# EAGLE design Temp_Control (EAGLE 9.6.2)
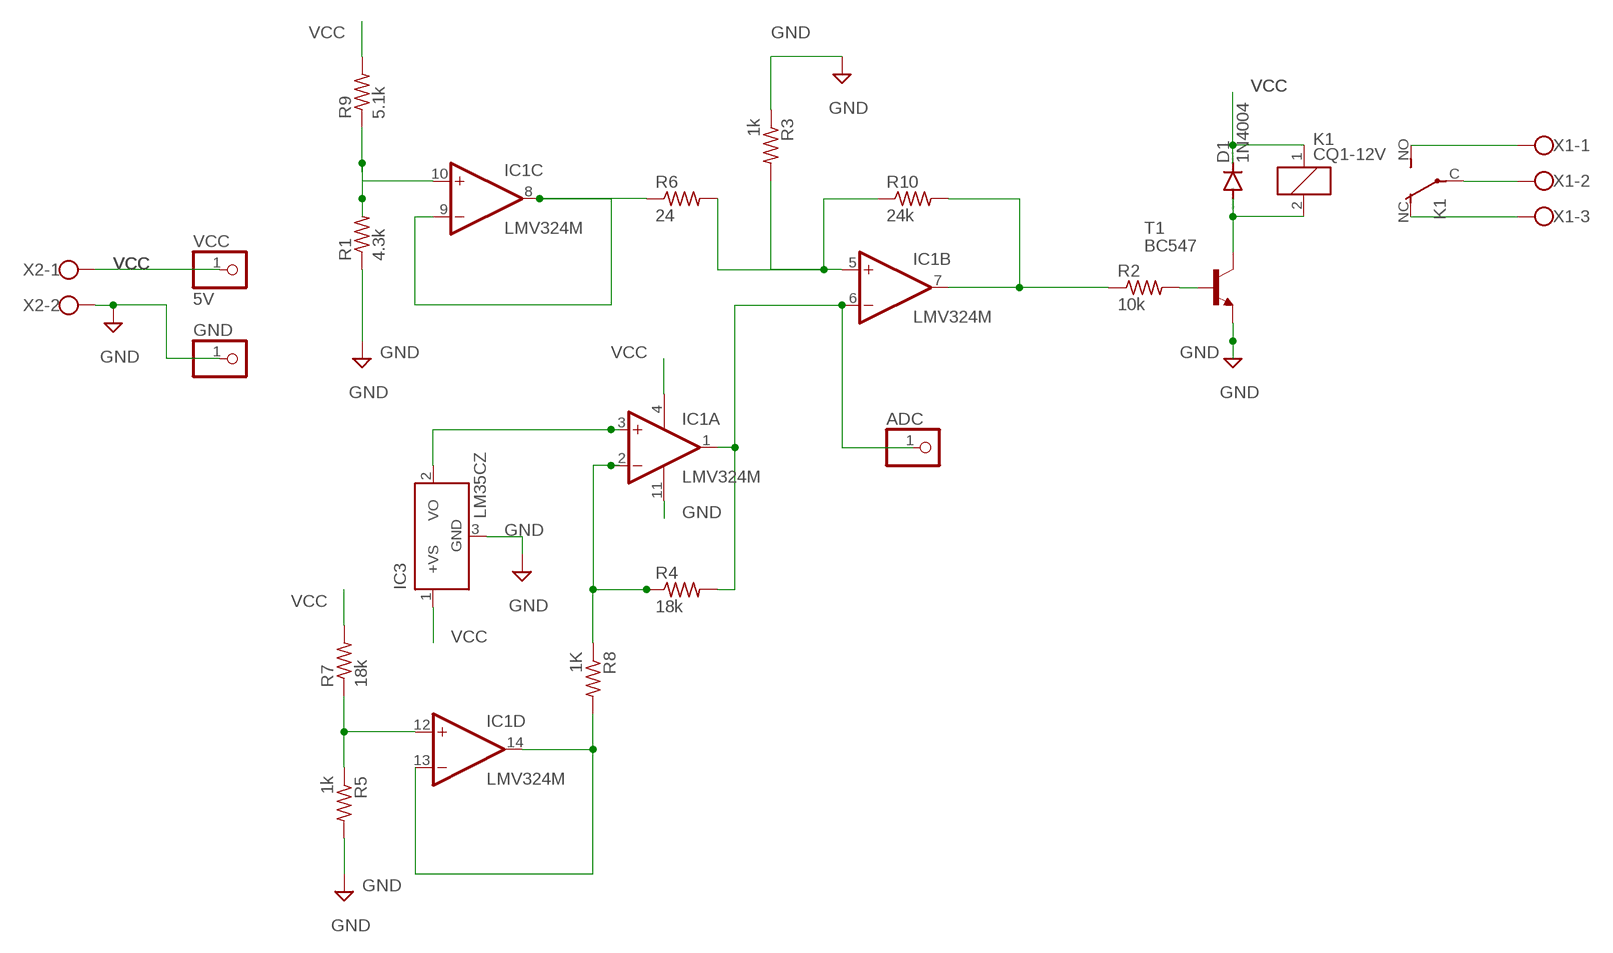
[diagram p0: schematic, sheet 1]

## Parts
ADC  PINHD-1X1  [1X01]
D1  1N4004  [DO41-10]
GND  PINHD-1X1  [1X01]
IC1  LMV324M  [SO14]
IC3  LM35CZ  [TO92]
K1  CQ1-12V  [CQ1]
R1  4.3k  R-US_0207/10  [0207/10]
R2  10k  R-US_0207/10  [0207/10]
R3  1k  R-US_0207/10  [0207/10]
R4  18k  R-US_0207/10  [0207/10]
R5  1k  R-US_0207/10  [0207/10]
R6  24  R-US_0207/10  [0207/10]
R7  18k  R-US_0207/10  [0207/10]
R8  1K  R-US_0207/10  [0207/10]
R9  5.1k  R-US_0207/10  [0207/10]
R10  24k  R-US_0207/10  [0207/10]
T1  BC547  [TO92]
VCC  5V  PINHD-1X1  [1X01]
X1  W237-103  [W237-103]
X2  W237-102  [W237-102]

## Nets
GND: GND.1 IC1.11(P:V-) IC3.3(GND) R1.1 R3.1 R5.2 T1.1(E) X2.2
N$1: IC1.3(A:+IN) IC3.2(VO)
N$2: IC1.2(A:-IN) R4.1 R8.1
N$3: ADC.1 IC1.1(A:OUT) IC1.6(B:-IN) R4.2
N$4: IC1.5(B:+IN) R3.2 R6.2 R10.1
N$5: IC1.7(B:OUT) R2.1 R10.2
N$6: IC1.10(C:+IN) R1.2 R9.1
N$7: IC1.8(C:OUT) IC1.9(C:-IN) R6.1
N$8: IC1.13(D:-IN) IC1.14(D:OUT) R8.2
N$9: R2.2 T1.2(B)
N$10: IC1.12(D:+IN) R5.1 R7.1
N$11: D1.A K1.2 T1.3(C)
N$12: K1.NO(2:S) X1.1
N$13: K1.C(2:P) X1.2
N$14: K1.NC(2:O) X1.3
VCC: D1.C IC1.4(P:V+) IC3.1(+VS) K1.1 R7.2 R9.2 VCC.1 X2.1

## Library data of the parts
ADC GND VCC = pinhead:PINHD-1X1: PIN HEADER
D1 = diode:1N4004: DIODE general purpose rectifier, 1 A
IC1 = linear:LMV324?*: Quad General Purpose, Low Voltage, Rail-to-Rail Output Operational Amplifiers Source: http://www.national.com/mpf/LM/LMV321.html http://www.national.com/dt/lmv_qual.pdf
IC3 = lm35:LM35: Single-Supply Centigrade Temperature Sensor Vout = (10mV/°C x Temp °C) +5mmmV Source: http://www.national.com/ds/LM/LM35.pdf
K1 = relay:CQ1-12V: AUTOMOTIVE QUIET RELAY NAiS Source: http://www.mew-europe.com/.. en_ds_61208_0000.pdf; OC_FARNELL: unknown; OC_NEWARK: unknown
R1-R10 = rcl:R-US_: RESISTOR, American symbol; SPICEPREFIX: R
T1 = transistor:BC547: NPN TRANSISTOR
X1 = con-wago-500:W237-103: WAGO SCREW CLAMP; MPN: 237-103; OC_FARNELL: unknown; OC_NEWARK: 18M7116
X2 = con-wago-500:W237-102: WAGO SCREW CLAMP; MPN: 237-102; OC_FARNELL: unknown; OC_NEWARK: 70K9898

## Board
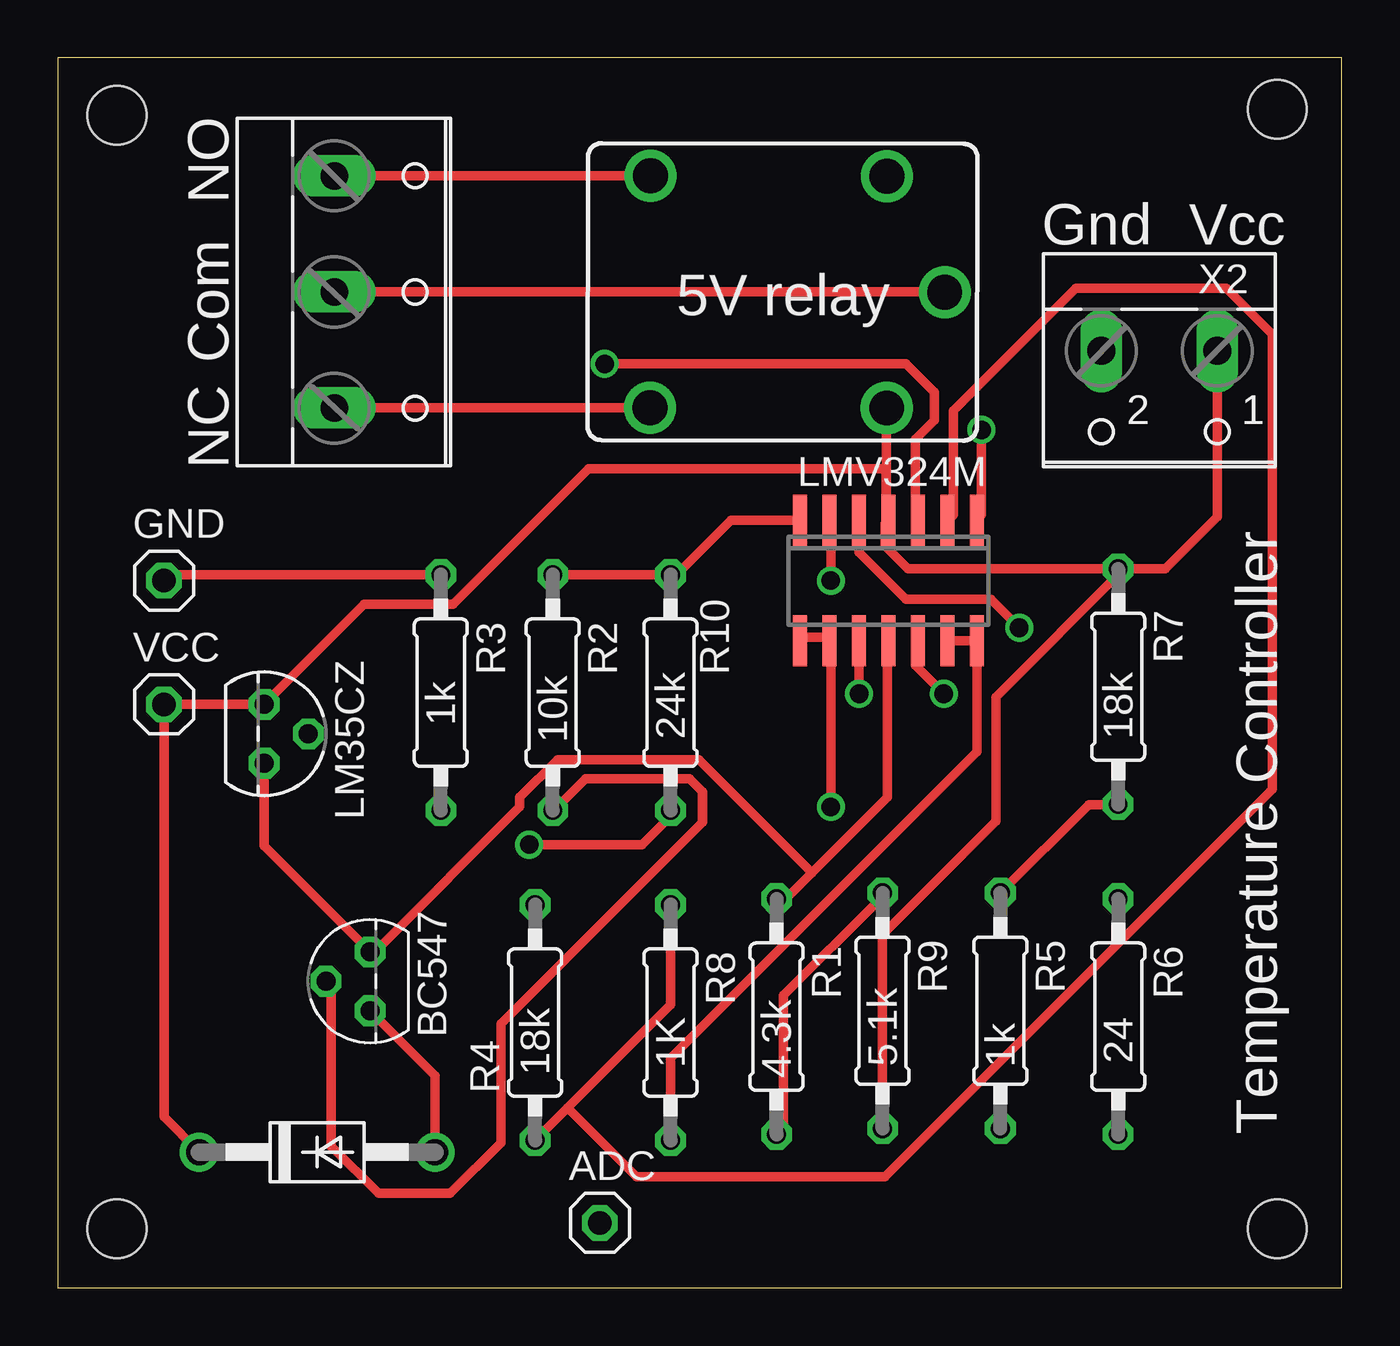
[diagram p1: board, top side]
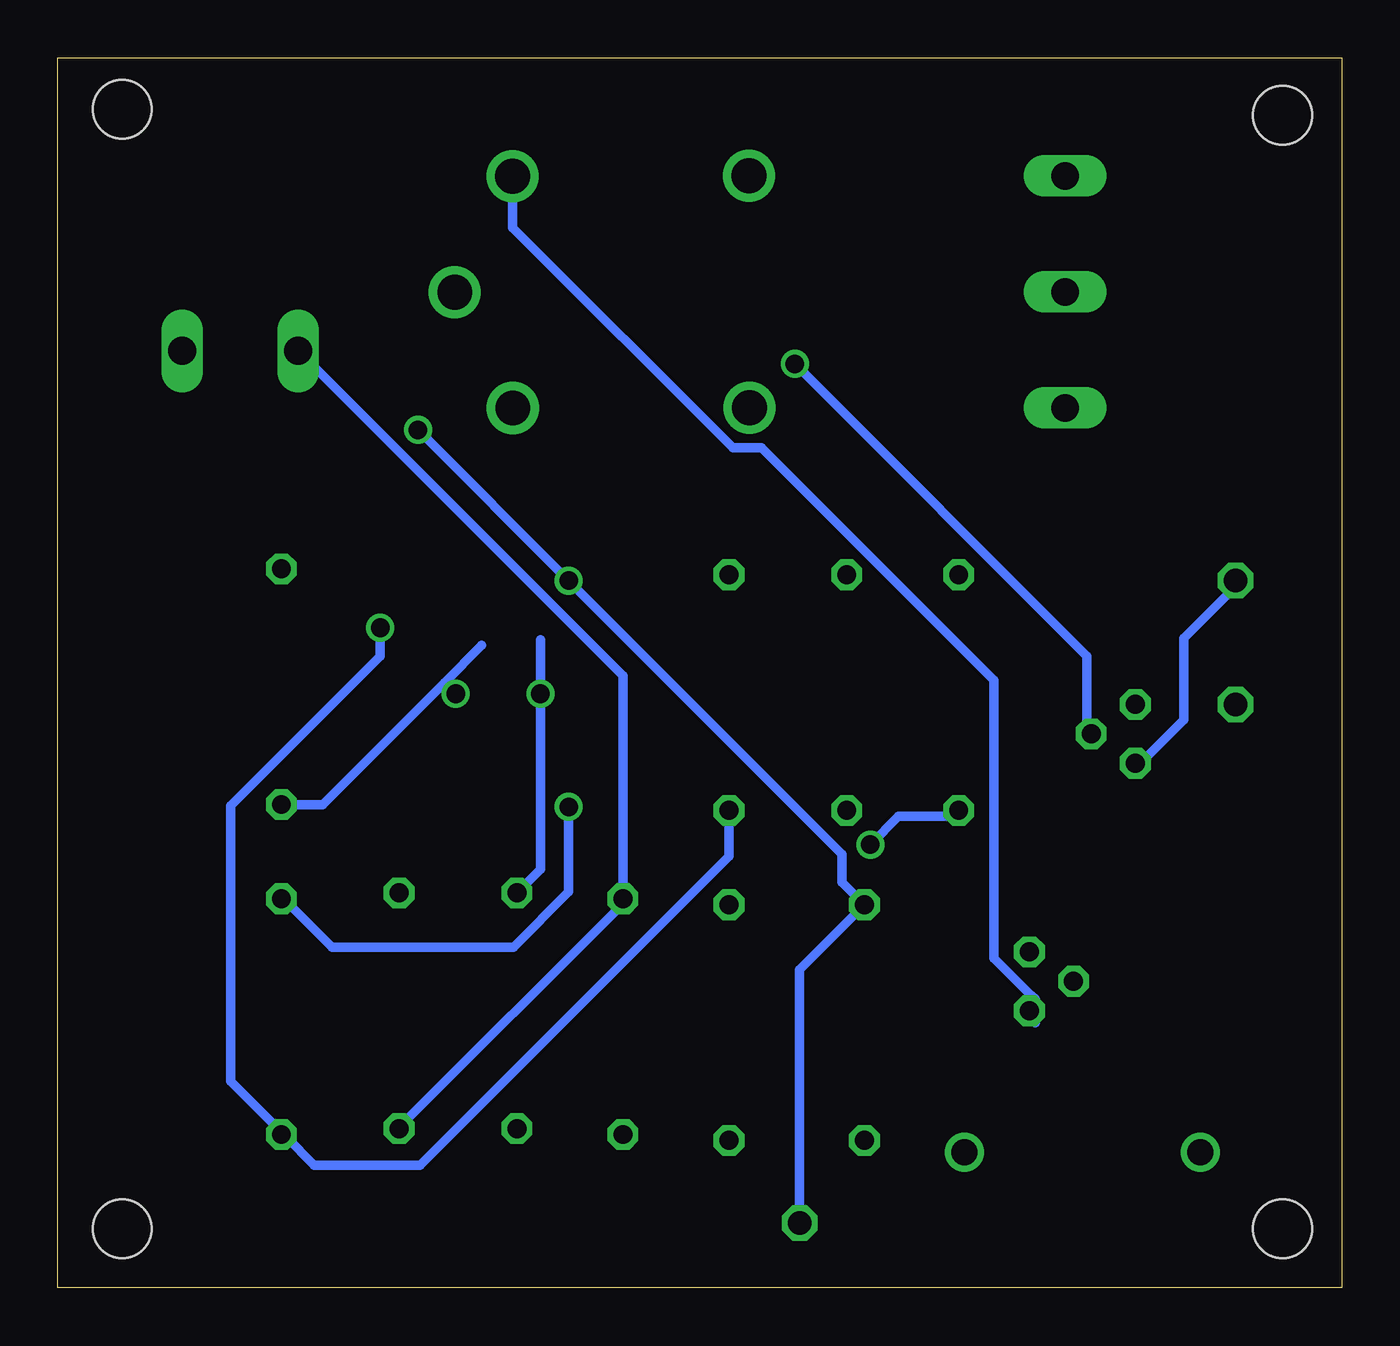
[diagram p2: board, bottom side, seen from below]

Size 55.35 x 53.01 mm. Coordinates in mm from the lower left corner, seen from the top.
Outline: 0,0 55.35,0 55.35,53.01 0,53.01 0,0
Copper layers (1*16): Top 0.035mm / dielectric 1.5mm / Bottom 0.035mm
Design rules "default *": minimum track width 16mil, minimum drill 0.8mm, track to track 16mil, track to pad 16mil, pad to pad 16mil, via to via 16mil, smd to smd 16mil, copper to edge 40mil, drill to drill 6mil, minimum pad ring 10mil, minimum via ring 8mil, stop-mask expansion 4mil, vias tented up to drill 0mil, thermal gap 10mil
Holes 2.54 mm at 2.54,50.55 52.58,50.8 52.58,2.54 2.54,2.54

### Footprints (pad centres in the part's own frame; a part is rotated, then mirrored left to right if it is on the bottom)
1X01 = drill 1.016 octagon: 1 0,0
DO41-10 = drill 1.118: A 5.08,0; C -5.08,0
SO14 = smd 0.6 x 2.2: 1 -3.81,-2.6; 2 -2.54,-2.6; 3 -1.27,-2.6; 4 0,-2.6; 5 1.27,-2.6; 6 2.54,-2.6; 7 3.81,-2.6; 8 3.81,2.6; 9 2.54,2.6; 10 1.27,2.6; 11 0,2.6; 12 -1.27,2.6; 13 -2.54,2.6; 14 -3.81,2.6
TO92 = drill 0.813 octagon: 1 -1.27,0; 2 0,1.905; 3 1.27,0
CQ1 = drill 1.5: 1 4.5,-5; 2 4.5,5; C 7,0; NC -5.7,-5; NO -5.7,5
0207/10 = drill 0.813 octagon: 1 -5.08,0; 2 5.08,0
TO92' = drill 0.813 octagon: 1 1.27,0; 2 0,1.905; 3 -1.27,0
W237-103 = drill 1.194 long: 1 -5,-1.29; 2 0,-1.29; 3 5,-1.29
W237-102 = drill 1.194 long: 1 -2.5,-1.27; 2 2.5,-1.27

### Placement (x,y rotation side)
ADC  23.37,2.79 0 top
D1  11.18,5.84 0 top
GND  4.57,30.48 0 top
IC1  35.81,30.48 180 top
IC3  8.89,23.88 270 top
K1  31.24,42.93 359.9 top
R1  30.99,11.68 270 top
R2  21.34,25.65 270 top
R3  16.51,25.65 270 top
R4  20.57,11.43 90 top
R5  40.64,11.94 270 top
R6  45.72,11.68 270 top
R7  45.72,25.91 90 top
R8  26.42,11.43 270 top
R9  35.56,11.94 270 top
R10  26.42,25.65 90 top
T1  BC547  [TO92']  13.46,13.21 90 top
VCC  4.57,25.15 0 top
X1  13.21,42.93 270 top
X2  47.5,39.12 180 top

### Tracks (layer width: path | path; a pad name or v marks a point on that pad's centre or on a via)
GND
  Top 0.406: IC3.3 8.89,19.05 T1.1 13.82,14.63 19.91,20.73 19.91,21.13 21.54,22.76 27.64,22.76 32.51,17.88 | R3.1 4.83,30.73 GND.1 | 32.51,17.88 31.29,16.66 R1.1 | 32.51,17.88 35.76,21.13 35.76,27.64 IC1.11
  Bottom 0.406: X2.2 30.99,26.38 R1.1 30.89,16.66 40.64,6.91 R5.2 | GND.1 4.57,30.23 6.81,27.99 6.81,24.49 8.53,22.76 IC3.3
N$1  (via drill 0.8)
  Top 0.406: v23.57,39.83 36.58,39.83 37.8,38.61 37.8,37.39 36.98,36.58 36.98,33.33 IC1.3
  Bottom 0.406: v23.57,39.83 10.97,27.23 10.97,23.98 IC3.2
N$2
  Top 0.406: R4.1 21.97,7.75 | 21.97,7.75 26.42,12.19 R8.1 | 21.97,7.75 24.94,4.78 35.66,4.78 52.38,21.49 52.38,41.1 50.39,43.08 43.89,43.08 38.61,37.8 38.61,33.33 IC1.2
N$3  (via drill 0.8)
  Top 0.406: v33.33,30.48 33.33,32.92 IC1.6 | v39.83,36.98 39.83,33.33 IC1.1
  Bottom 0.406: ADC.1 23.37,13.72 R4.2 21.54,17.48 21.54,18.69 v33.33,30.48 v39.83,36.98
N$4  (via drill 0.8)
  Top 0.406: v20.32,19.1 25.2,19.1 26.42,20.32 R10.1 | IC1.5 34.54,31.7 36.58,29.67 40.23,29.67 v41.45,28.45
  Bottom 0.406: v20.32,19.1 19.1,20.32 16.66,20.32 R3.2 | v41.45,28.45 41.45,27.23 47.9,20.78 47.9,8.89 45.92,6.91 R6.2 45.52,6.5 44.3,5.28 39.73,5.28 26.42,18.59 R10.1
N$5
  Top 0.406: R2.1 26.16,30.73 R10.2 26.67,30.73 29.02,33.08 IC1.7
N$6  (via drill 0.8)
  Top 0.406: v34.54,25.6 IC1.10 | R9.1 35.36,16.66 31.29,12.6 31.29,6.91 R1.2
  Bottom 0.406: R9.1 34.54,18.03 v34.54,25.6 34.54,27.94
N$7  (via drill 0.8)
  Top 0.406: IC1.8 32.11,28.04 33.33,28.04 IC1.9 33.33,27.64 v33.33,20.73
  Bottom 0.406: v33.33,20.73 33.33,17.07 35.71,14.68 43.54,14.68 45.52,16.66 R6.1
N$8
  Top 0.406: R8.2 26.42,9.89 39.62,23.1 39.62,27.69 | 39.62,27.69 IC1.14 | IC1.13 39.43,27.88 39.62,27.69
N$9
  Top 0.406: T1.2 11.79,13.01 11.79,6.1 13.82,4.06 16.92,4.06 19.1,6.25 19.1,11.38 27.79,20.07 27.79,21.39 27.23,21.95 22.76,21.95 21.54,20.73 R2.2
N$10  (via drill 0.8)
  Top 0.406: R5.1 44.45,20.83 R7.1 | v38.2,25.6 36.98,26.82 36.98,27.64 IC1.12
  Bottom 0.406: R7.1 43.94,20.83 38.68,26.09 | 38.68,26.09 37.08,27.69 | 38.68,26.09 v38.2,25.6
N$11
  Top 0.406: T1.3 16.26,9.14 D1.A
  Bottom 0.406: K1.2 35.75,45.7 26.25,36.2 25.01,36.2 14.99,26.18 14.99,14.21 13.39,12.62 | 13.21,11.43 13.21,12.43 13.39,12.62 | T1.3 13.41,12.19 13.41,12.6 13.39,12.62
N$12
  Top 0.406: X1.1 25.54,47.93 K1.NO
N$13
  Top 0.406: X1.2 38.23,42.93 K1.C
N$14
  Top 0.406: X1.3 25.52,37.93 K1.NC
VCC
  Top 0.406: X2.1 50,33.23 47.75,30.99 45.97,30.99 | 45.97,30.99 R7.2 36.66,30.99 35.67,31.98 35.67,32.93 IC1.4 | D1.C 4.57,7.37 VCC.1 IC3.1 13.21,29.46 17.04,29.46 22.87,35.3 35.71,35.3 35.71,33.19 IC1.4 | K1.1 35.73,33.16 IC1.4 | 45.97,30.99 40.44,25.45 40.44,20.1 35.56,15.22 R9.2

### Text on the board
tPlace: Temperature Controller
tNames: NO | Gnd | Vcc | 5V relay | Com | NC